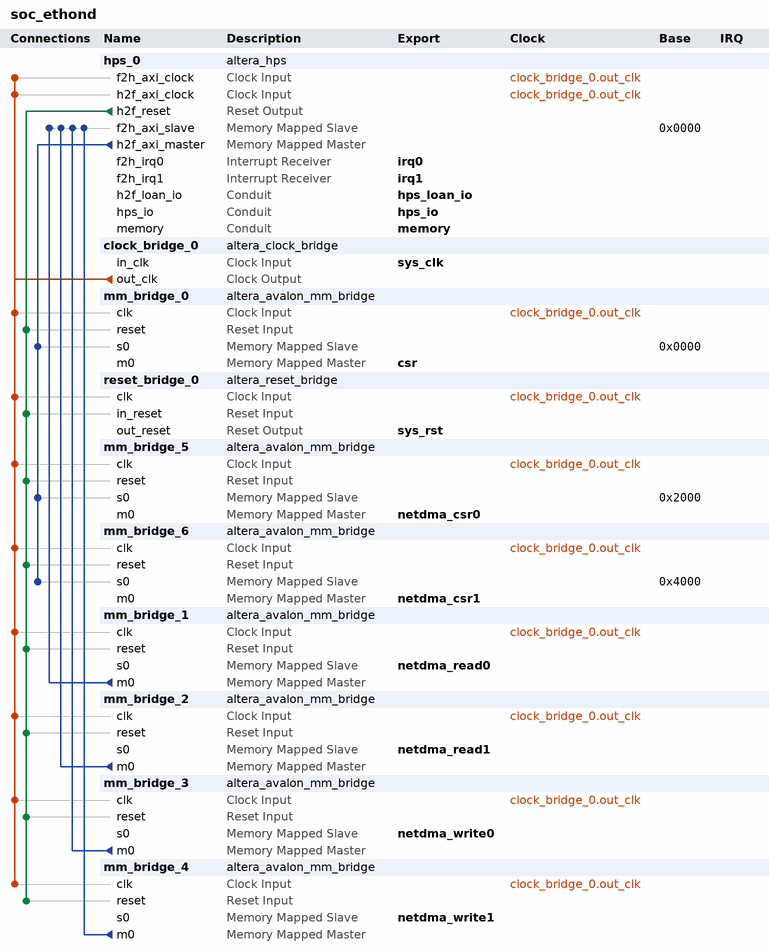
[diagram p0: system contents]
# Platform Designer (Qsys) system soc_ethond, Cyclone V 5CSEBA4U19C8
# Parameters at their usual value, and those the tool derives, are not listed.
package require -exact qsys 14.0
create_system soc_ethond
set_project_property DEVICE_FAMILY {Cyclone V}
set_project_property DEVICE 5CSEBA4U19C8

add_instance hps_0 altera_hps 14.0
set_instance_parameter_value hps_0 MEM_VENDOR Other
set_instance_parameter_value hps_0 MEM_ROW_ADDR_WIDTH 15
set_instance_parameter_value hps_0 MEM_COL_ADDR_WIDTH 10
set_instance_parameter_value hps_0 MEM_DQ_WIDTH 32
set_instance_parameter_value hps_0 MEM_BANKADDR_WIDTH 3
set_instance_parameter_value hps_0 MEM_ASR Automatic
set_instance_parameter_value hps_0 MEM_PD {DLL on}
set_instance_parameter_value hps_0 MEM_DRV_STR RZQ/6
set_instance_parameter_value hps_0 MEM_RTT_NOM RZQ/6
set_instance_parameter_value hps_0 MEM_RTT_WR {Dynamic ODT off}
set_instance_parameter_value hps_0 MEM_WTCL 5
set_instance_parameter_value hps_0 MEM_TCL 5
set_instance_parameter_value hps_0 TIMING_TIS 185
set_instance_parameter_value hps_0 TIMING_TIH 130
set_instance_parameter_value hps_0 TIMING_TDS 25
set_instance_parameter_value hps_0 TIMING_TDH 55
set_instance_parameter_value hps_0 TIMING_TDQSQ 100
set_instance_parameter_value hps_0 TIMING_TDQSCK 255
set_instance_parameter_value hps_0 TIMING_TDQSS 0.27
set_instance_parameter_value hps_0 TIMING_TQSH 0.4
set_instance_parameter_value hps_0 TIMING_TDSH 0.18
set_instance_parameter_value hps_0 TIMING_TDSS 0.18
set_instance_parameter_value hps_0 MEM_TRAS_NS 35.0
set_instance_parameter_value hps_0 MEM_TRCD_NS 13.75
set_instance_parameter_value hps_0 MEM_TRP_NS 13.75
set_instance_parameter_value hps_0 MEM_TRFC_NS 260.0
set_instance_parameter_value hps_0 MEM_TWTR 5
set_instance_parameter_value hps_0 MEM_TFAW_NS 40.0
set_instance_parameter_value hps_0 REF_CLK_FREQ 25.0
set_instance_parameter_value hps_0 MEM_VOLTAGE {1.35V DDR3L}
set_instance_parameter_value hps_0 TIMING_BOARD_MAX_CK_DELAY 0.6
set_instance_parameter_value hps_0 TIMING_BOARD_MAX_DQS_DELAY 0.6
set_instance_parameter_value hps_0 TIMING_BOARD_SKEW_CKDQS_DIMM_MIN -0.01
set_instance_parameter_value hps_0 TIMING_BOARD_SKEW_CKDQS_DIMM_MAX 0.01
set_instance_parameter_value hps_0 TIMING_BOARD_SKEW_WITHIN_DQS 0.02
set_instance_parameter_value hps_0 TIMING_BOARD_SKEW_BETWEEN_DQS 0.02
set_instance_parameter_value hps_0 TIMING_BOARD_DQ_TO_DQS_SKEW 0.0
set_instance_parameter_value hps_0 TIMING_BOARD_AC_SKEW 0.02
set_instance_parameter_value hps_0 TIMING_BOARD_AC_TO_CK_SKEW 0.0
set_instance_parameter_value hps_0 MEM_CLK_FREQ 333.0
set_instance_parameter_value hps_0 HPS_PROTOCOL DDR3
set_instance_parameter_value hps_0 desired_cfg_clk_mhz 100.0
set_instance_parameter_value hps_0 desired_nand_clk_mhz 200.0
set_instance_parameter_value hps_0 desired_qspi_clk_mhz 400.0
set_instance_parameter_value hps_0 STM_Enable false
set_instance_parameter_value hps_0 F2S_Width 2
set_instance_parameter_value hps_0 S2F_Width 1
set_instance_parameter_value hps_0 LWH2F_Enable false
set_instance_parameter_value hps_0 F2SCLK_DBGRST_Enable false
set_instance_parameter_value hps_0 F2SCLK_WARMRST_Enable false
set_instance_parameter_value hps_0 F2SCLK_COLDRST_Enable false
set_instance_parameter_value hps_0 F2SINTERRUPT_Enable true
set_instance_parameter_value hps_0 EMAC1_PinMuxing {HPS I/O Set 0}
set_instance_parameter_value hps_0 EMAC1_Mode RGMII
set_instance_parameter_value hps_0 QSPI_PinMuxing {HPS I/O Set 0}
set_instance_parameter_value hps_0 QSPI_Mode {1 SS}
set_instance_parameter_value hps_0 SDIO_PinMuxing {HPS I/O Set 0}
set_instance_parameter_value hps_0 SDIO_Mode {4-bit Data}
set_instance_parameter_value hps_0 USB1_PinMuxing {HPS I/O Set 0}
set_instance_parameter_value hps_0 USB1_Mode SDR
set_instance_parameter_value hps_0 SPIM1_PinMuxing Unused
set_instance_parameter_value hps_0 SPIM1_Mode N/A
set_instance_parameter_value hps_0 UART0_PinMuxing {HPS I/O Set 0}
set_instance_parameter_value hps_0 UART0_Mode {No Flow Control}
set_instance_parameter_value hps_0 I2C0_PinMuxing {HPS I/O Set 1}
set_instance_parameter_value hps_0 I2C0_Mode I2C
set_instance_parameter_value hps_0 I2C1_PinMuxing Unused
set_instance_parameter_value hps_0 I2C1_Mode N/A
set_instance_parameter_value hps_0 FPGA_PERIPHERAL_OUTPUT_CLOCK_FREQ_EMAC0_MD_CLK 2
set_instance_parameter_value hps_0 FPGA_PERIPHERAL_OUTPUT_CLOCK_FREQ_EMAC0_GTX_CLK 125
set_instance_parameter_value hps_0 FPGA_PERIPHERAL_OUTPUT_CLOCK_FREQ_EMAC1_MD_CLK 2
set_instance_parameter_value hps_0 FPGA_PERIPHERAL_OUTPUT_CLOCK_FREQ_EMAC1_GTX_CLK 125

add_instance clock_bridge_0 altera_clock_bridge 14.0
set_instance_parameter_value clock_bridge_0 DERIVED_CLOCK_RATE 0
set_instance_parameter_value clock_bridge_0 EXPLICIT_CLOCK_RATE 0

add_instance mm_bridge_0 altera_avalon_mm_bridge 14.0
set_instance_parameter_value mm_bridge_0 DATA_WIDTH 32
set_instance_parameter_value mm_bridge_0 ADDRESS_WIDTH 13
set_instance_parameter_value mm_bridge_0 USE_AUTO_ADDRESS_WIDTH 0
set_instance_parameter_value mm_bridge_0 ADDRESS_UNITS SYMBOLS
set_instance_parameter_value mm_bridge_0 MAX_PENDING_RESPONSES 1

add_instance reset_bridge_0 altera_reset_bridge 14.0
set_instance_parameter_value reset_bridge_0 ACTIVE_LOW_RESET 0
set_instance_parameter_value reset_bridge_0 SYNCHRONOUS_EDGES deassert

add_instance mm_bridge_5 altera_avalon_mm_bridge 14.0
set_instance_parameter_value mm_bridge_5 DATA_WIDTH 32
set_instance_parameter_value mm_bridge_5 ADDRESS_WIDTH 13
set_instance_parameter_value mm_bridge_5 USE_AUTO_ADDRESS_WIDTH 0
set_instance_parameter_value mm_bridge_5 ADDRESS_UNITS SYMBOLS
set_instance_parameter_value mm_bridge_5 MAX_PENDING_RESPONSES 1

add_instance mm_bridge_6 altera_avalon_mm_bridge 14.0
set_instance_parameter_value mm_bridge_6 DATA_WIDTH 32
set_instance_parameter_value mm_bridge_6 ADDRESS_WIDTH 13
set_instance_parameter_value mm_bridge_6 USE_AUTO_ADDRESS_WIDTH 0
set_instance_parameter_value mm_bridge_6 ADDRESS_UNITS SYMBOLS
set_instance_parameter_value mm_bridge_6 MAX_PENDING_RESPONSES 1

add_instance mm_bridge_1 altera_avalon_mm_bridge 14.0
set_instance_parameter_value mm_bridge_1 DATA_WIDTH 64
set_instance_parameter_value mm_bridge_1 ADDRESS_WIDTH 32
set_instance_parameter_value mm_bridge_1 USE_AUTO_ADDRESS_WIDTH 0
set_instance_parameter_value mm_bridge_1 ADDRESS_UNITS WORDS
set_instance_parameter_value mm_bridge_1 MAX_PENDING_RESPONSES 1
set_instance_parameter_value mm_bridge_1 PIPELINE_COMMAND 0
set_instance_parameter_value mm_bridge_1 PIPELINE_RESPONSE 0

add_instance mm_bridge_2 altera_avalon_mm_bridge 14.0
set_instance_parameter_value mm_bridge_2 DATA_WIDTH 64
set_instance_parameter_value mm_bridge_2 ADDRESS_WIDTH 32
set_instance_parameter_value mm_bridge_2 USE_AUTO_ADDRESS_WIDTH 0
set_instance_parameter_value mm_bridge_2 ADDRESS_UNITS WORDS
set_instance_parameter_value mm_bridge_2 MAX_PENDING_RESPONSES 1
set_instance_parameter_value mm_bridge_2 PIPELINE_COMMAND 0
set_instance_parameter_value mm_bridge_2 PIPELINE_RESPONSE 0

add_instance mm_bridge_3 altera_avalon_mm_bridge 14.0
set_instance_parameter_value mm_bridge_3 DATA_WIDTH 64
set_instance_parameter_value mm_bridge_3 ADDRESS_WIDTH 32
set_instance_parameter_value mm_bridge_3 USE_AUTO_ADDRESS_WIDTH 0
set_instance_parameter_value mm_bridge_3 ADDRESS_UNITS WORDS
set_instance_parameter_value mm_bridge_3 MAX_PENDING_RESPONSES 1
set_instance_parameter_value mm_bridge_3 PIPELINE_COMMAND 0
set_instance_parameter_value mm_bridge_3 PIPELINE_RESPONSE 0

add_instance mm_bridge_4 altera_avalon_mm_bridge 14.0
set_instance_parameter_value mm_bridge_4 DATA_WIDTH 64
set_instance_parameter_value mm_bridge_4 ADDRESS_WIDTH 32
set_instance_parameter_value mm_bridge_4 USE_AUTO_ADDRESS_WIDTH 0
set_instance_parameter_value mm_bridge_4 ADDRESS_UNITS WORDS
set_instance_parameter_value mm_bridge_4 MAX_PENDING_RESPONSES 1
set_instance_parameter_value mm_bridge_4 PIPELINE_COMMAND 0
set_instance_parameter_value mm_bridge_4 PIPELINE_RESPONSE 0

# connections
add_connection clock_bridge_0.out_clk hps_0.f2h_axi_clock clock
add_connection clock_bridge_0.out_clk hps_0.h2f_axi_clock clock
add_connection clock_bridge_0.out_clk mm_bridge_0.clk clock
add_connection clock_bridge_0.out_clk mm_bridge_1.clk clock
add_connection clock_bridge_0.out_clk mm_bridge_2.clk clock
add_connection clock_bridge_0.out_clk mm_bridge_3.clk clock
add_connection clock_bridge_0.out_clk mm_bridge_4.clk clock
add_connection clock_bridge_0.out_clk mm_bridge_5.clk clock
add_connection clock_bridge_0.out_clk mm_bridge_6.clk clock
add_connection clock_bridge_0.out_clk reset_bridge_0.clk clock
add_connection hps_0.h2f_reset mm_bridge_0.reset reset
add_connection hps_0.h2f_reset mm_bridge_1.reset reset
add_connection hps_0.h2f_reset mm_bridge_2.reset reset
add_connection hps_0.h2f_reset mm_bridge_3.reset reset
add_connection hps_0.h2f_reset mm_bridge_4.reset reset
add_connection hps_0.h2f_reset mm_bridge_5.reset reset
add_connection hps_0.h2f_reset mm_bridge_6.reset reset
add_connection hps_0.h2f_reset reset_bridge_0.in_reset reset
add_connection hps_0.h2f_axi_master mm_bridge_0.s0 avalon
set_connection_parameter_value hps_0.h2f_axi_master/mm_bridge_0.s0 baseAddress 0x0000
add_connection hps_0.h2f_axi_master mm_bridge_5.s0 avalon
set_connection_parameter_value hps_0.h2f_axi_master/mm_bridge_5.s0 baseAddress 0x2000
add_connection hps_0.h2f_axi_master mm_bridge_6.s0 avalon
set_connection_parameter_value hps_0.h2f_axi_master/mm_bridge_6.s0 baseAddress 0x4000
add_connection mm_bridge_1.m0 hps_0.f2h_axi_slave avalon
set_connection_parameter_value mm_bridge_1.m0/hps_0.f2h_axi_slave baseAddress 0x0000
add_connection mm_bridge_2.m0 hps_0.f2h_axi_slave avalon
set_connection_parameter_value mm_bridge_2.m0/hps_0.f2h_axi_slave baseAddress 0x0000
add_connection mm_bridge_3.m0 hps_0.f2h_axi_slave avalon
set_connection_parameter_value mm_bridge_3.m0/hps_0.f2h_axi_slave baseAddress 0x0000
add_connection mm_bridge_4.m0 hps_0.f2h_axi_slave avalon
set_connection_parameter_value mm_bridge_4.m0/hps_0.f2h_axi_slave baseAddress 0x0000

# exported interfaces
add_interface memory conduit end
set_interface_property memory EXPORT_OF hps_0.memory
add_interface hps_io conduit end
set_interface_property hps_io EXPORT_OF hps_0.hps_io
add_interface sys_clk clock sink
set_interface_property sys_clk EXPORT_OF clock_bridge_0.in_clk
add_interface sys_rst reset source
set_interface_property sys_rst EXPORT_OF reset_bridge_0.out_reset
add_interface hps_loan_io conduit end
set_interface_property hps_loan_io EXPORT_OF hps_0.h2f_loan_io
add_interface irq0 interrupt receiver
set_interface_property irq0 EXPORT_OF hps_0.f2h_irq0
add_interface irq1 interrupt receiver
set_interface_property irq1 EXPORT_OF hps_0.f2h_irq1
add_interface netdma_csr0 avalon master
set_interface_property netdma_csr0 EXPORT_OF mm_bridge_5.m0
add_interface netdma_csr1 avalon master
set_interface_property netdma_csr1 EXPORT_OF mm_bridge_6.m0
add_interface netdma_write0 avalon slave
set_interface_property netdma_write0 EXPORT_OF mm_bridge_3.s0
add_interface netdma_write1 avalon slave
set_interface_property netdma_write1 EXPORT_OF mm_bridge_4.s0
add_interface netdma_read0 avalon slave
set_interface_property netdma_read0 EXPORT_OF mm_bridge_1.s0
add_interface netdma_read1 avalon slave
set_interface_property netdma_read1 EXPORT_OF mm_bridge_2.s0
add_interface csr avalon master
set_interface_property csr EXPORT_OF mm_bridge_0.m0

set_interconnect_requirement {$system} qsys_mm.clockCrossingAdapter HANDSHAKE
set_interconnect_requirement {$system} qsys_mm.maxAdditionalLatency 1
set_interconnect_requirement {$system} qsys_mm.insertDefaultSlave FALSE

save_system soc_ethond.qsys
